# Altium schematic sheet Schematic.SchDoc
size 420 x 297 mm; SheetNumber: 1; SheetTotal: 1; Scale: ---; Title1str: {Наименование строка 2}; PageSetup: Record=PageOptions|CenterHorizontal=False|CenterVertical=False|PrintScale=0.95|XCorrection=0.00|YCorrection=0.00|PrintKind=1|BorderSize=5000000|LeftOffset=0|BottomOffset=0|Orientation=1|PaperLength=1000|PaperWidth=1000|Scale=100|PaperSource=15|PrintQuality=600|MediaType=1|DitherType=10|PaperKind=A4|PrintScaleMode=1; Title2str: {Наименование строка 3}; ProcessInspection: {Т.контр.}; Mass: ---; NormInspection: {Н.контр.}; Letter1Column: О; Letter2Column: {L}; DocumentType: {Документ}; DocumentType1str: {Документ}; DocumentType2str: {Документ}; SpravNomer: {Справ. №}; Title3str: Схема электрическая принципиальная
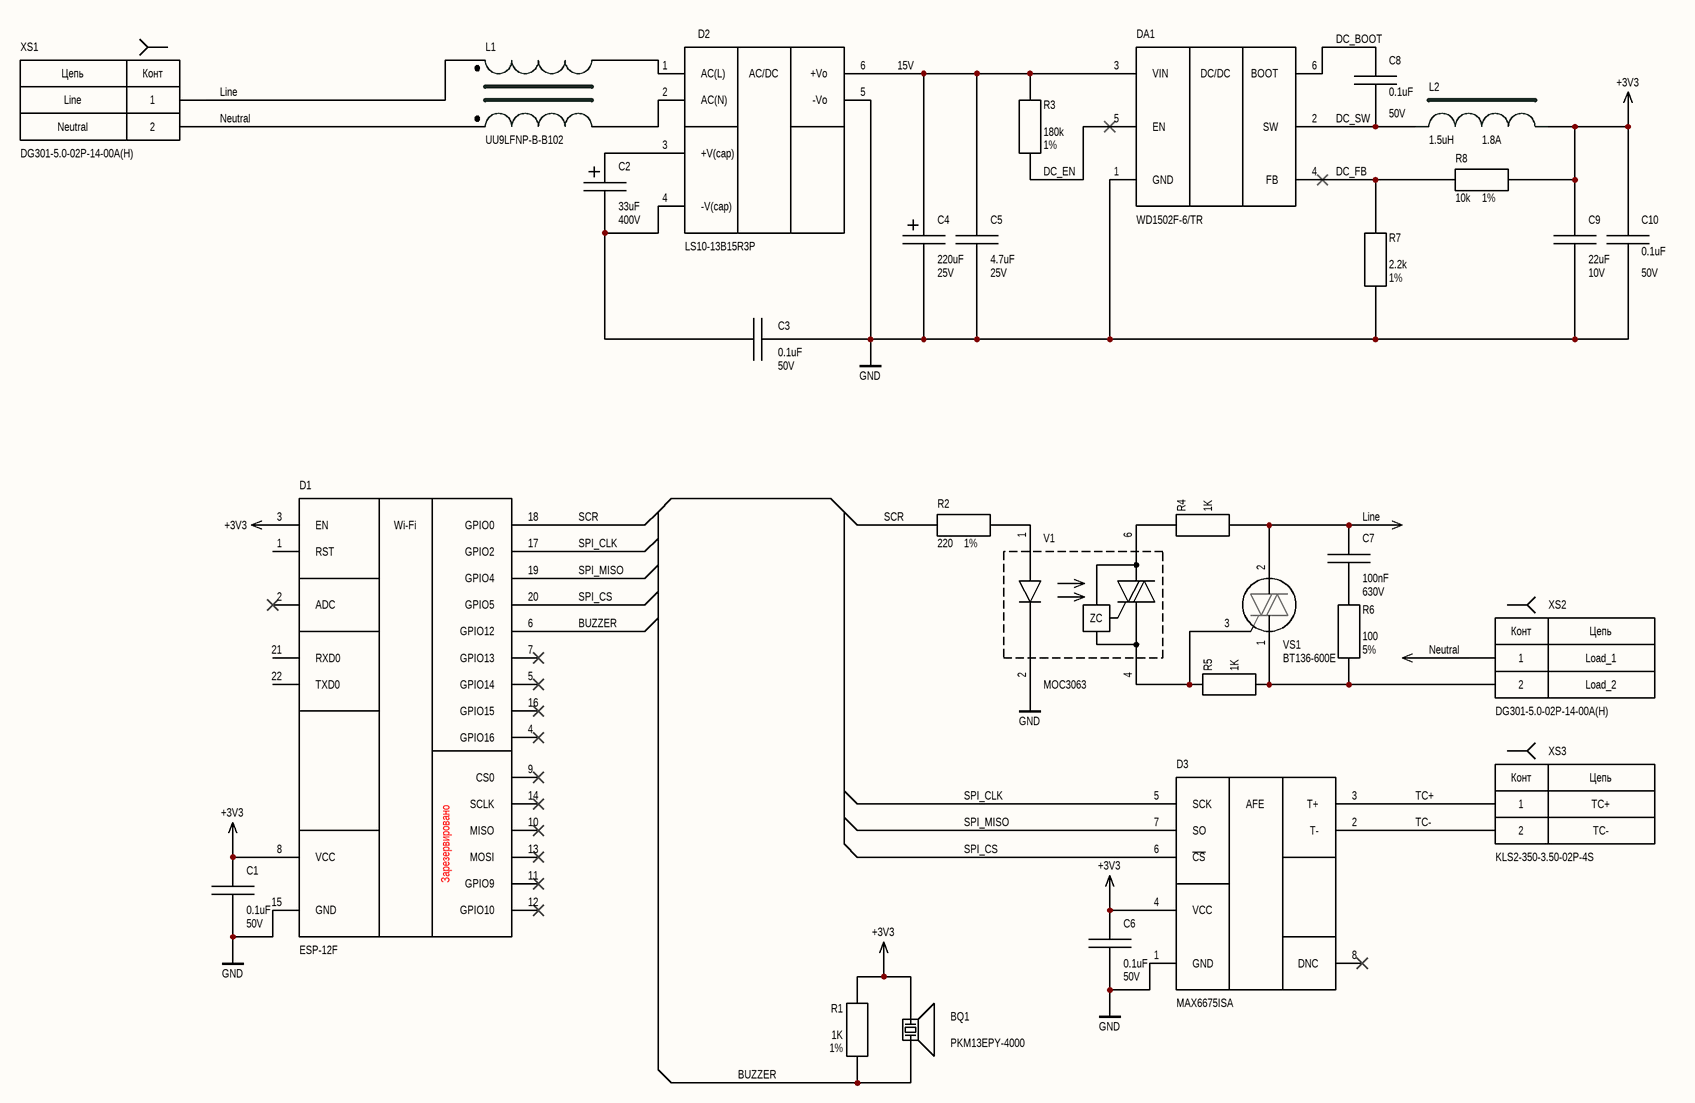
[diagram p0: Schematic.SchDoc]

## Parts
BQ1  PKM13EPY-4000  [R_D12p6_H6p9_S5_d0p5]
C1  0.1uF  Parameter: 50V  [CAPC1608X09N]
C2  33uF  Parameter: 400V
C3  0.1uF  Parameter: 50V  [CAPC1608X09N]
C4  220uF  Parameter: 25V
C5  4.7uF  Parameter: 25V  [CAPC3216X19N]
C6  0.1uF  Parameter: 50V  [CAPC1608X09N]
C7  100nF  Parameter: 630V  [CAPRR1600W70L1750T600H1200]
C8  0.1uF  Parameter: 50V  [CAPC1608X09N]
C9  22uF  Parameter: 10V  [CAPC3216X19N]
C10  0.1uF  Parameter: 50V  [CAPC1608X09N]
D1  ESP-12F  [ESP-12F]
D2  LS10-13B15R3P  [LS10-13BxxR3P_LUT]
D3  MAX6675ISA  [SOIC8P127_490X600X175L83X42N]
DA1  WD1502F-6/TR  [SOT23-6P95_280X90L45X42N]
L1  UU9LFNP-B-B102  [UU9LF]
L2  1.5uH  Parameter: 1.8A  [INDP400L400WX180_N]
R1  1K  Parameter: 1%  [RESC1608X55N]
R2  220  Parameter: 1%  [RESC1608X55N]
R3  180k  Parameter: 1%  [RESC1608X55N]
R4  1K  [RESC1608X55N]
R5  1K  [RESC1608X55N]
R6  100  Parameter: 5%  [MF-05W_RESAD1400W60L1000D500]
R7  2.2k  Parameter: 1%  [RESC1608X55N]
R8  10k  Parameter: 1%  [RESC1608X55N]
V1  MOC3063  [DIP-6_DIP762W50P254L735H400Q6]
VS1  BT136-600Е  [TO-220C_TO254_440P1040X460X2000-3]
XS1  DG301-5.0-02P-14-00A(H)  [DG301-5.0-02P]
XS2  DG301-5.0-02P-14-00A(H)  [DG301-5.0-02P]
XS3  KLS2-350-3.50-02P-4S  [KLS2-350-3.50-02P-4S]

## Nets
+3V3: BQ1.1 C1.1 C6.1 C9.1 C10.1 D1.3(EN) D1.8(VCC) D3.4(VCC) L2.2 R1.2 R8.2
GND: C1.2 C3.2 C4.1 C5.2 C6.2 C9.2 C10.2 D1.15(GND) D2.5(-Vo) D3.1(GND) DA1.1(GND) R7.1 V1.2(-)
15V: C4.2 C5.1 D2.6(+Vo) DA1.3(VIN) R3.2
BUZZER: BQ1.2 D1.6(GPIO12) R1.1
DC_BOOT: C8.1 DA1.6(BOOT)
DC_EN: DA1.5(EN) R3.1
DC_FB: DA1.4(FB) R7.2 R8.1
DC_SW: C8.2 DA1.2(SW) L2.1
Line: C7.1 L1.1 R4.1 VS1.2(T2) XS1.1
Neutral: L1.4 XS1.2 XS2.1
SCR: D1.18(GPIO0) R2.1
SPI_CLK: D1.17(GPIO2) D3.5(SCK)
SPI_CS: D1.20(GPIO5) D3.6(~{CS})
SPI_MISO: D1.19(GPIO4) D3.7(SO)
TC+: D3.3(T+) XS3.1
TC-: D3.2(T-) XS3.2
NetC2_1: C2.1 C3.1 D2.4(-V(cap))
NetC2_2: C2.2 D2.3(+V(cap))
NetC7_2: C7.2 R6.2
NetD2_1: D2.1(AC(L)) L1.2
NetD2_2: D2.2(AC(N)) L1.3
NetR2_2: R2.2 V1.1(+)
NetR4_2: R4.2 V1.6
NetR5_1: R5.1 R6.1 VS1.1(T1) XS2.2
NetR5_2: R5.2 V1.4 VS1.3(G)

Not connected (* = marked no-connect by the designer): D1 1(RST) 2(ADC)* 4(GPIO16)* 5(GPIO14)* 7(GPIO13)* 9(CS0)* 10(MISO)* 11(GPIO9)* 12(GPIO10)* 13(MOSI)* 14(SCLK)* 16(GPIO15)* 21(RXD0) 22(TXD0); D3 8(DNC)*

## Notes on the sheet
- Line
- Neutral
- Load_1
- Load_2
- TC+
- TC-
- Перв. примен.
- Справ. №
- Подп. и дата
- Инв. № дубл.
- Взам. инв. №
- Изм.
- Лист
- № докум.
- Подп.
- Дата
- Лит.
- Масса
- Масштаб
- Т.контр.
- Пров.
- Разраб.
- Листов
- Инв. № подл.
- Н. контр.
- Утв.
- Копировал:
- Формат А3
- (in symbol DG301-5.0-02P-14-00A(H)) Цепь; Конт
- (in symbol ESP-12F) Wi-Fi; Зарезервировано
- (in symbol KLS2-350-3.50-02P-4S) Конт; Цепь
- (in symbol LS10-13B15R3P) AC/DC
- (in symbol MAX6675ISA) AFE
- (in symbol MOC3063) ZC
- (in symbol WD1502F-6/TR) DC/DC

## Library data of the parts
BQ1 = PKM13EPY-4000: Manufacturer: Murata; Part Number: PKM13EPY-4000; ComponentLink1URL: https://pdf1.alldatasheet.com/datasheet-pdf/view/116967/MURATA/PKM13EPY-4000-A0.html; ComponentLink1Description: Datasheet; Package: TH; Part Status: Active
C1 C3 C6 C8 C10 = 0603-0.1uF-50V-10%-X7R: Tolerance: 10%; Dielectric: X7R; Min Temperature: -55; Max Temperature: 125; Part Number: 0603-0.1uF-50V-10%-X7R; Package: 0603; Part Status: Active; Capacitance: 0.1uF; Voltage: 50V
C2 = SHG33UF400V01EC1480: Manufacturer: KNSCHA; Part Number: SHG33UF400V01EC1480; ComponentLink1URL: https://datasheet.lcsc.com/lcsc/2204261000_KNSCHA-SHG33UF400V01EC1480_C2998036.pdf; ComponentLink1Description: Datasheet; Capacitance: 33uF; Voltage: 400V
C4 = 03EC0360: Manufacturer: KNSCHA; Part Number: 03EC0360; ComponentLink1URL: https://datasheet.lcsc.com/lcsc/2105241444_KNSCHA-03EC0360_C2833303.pdf; ComponentLink1Description: Datasheet; Capacitance: 220uF; Voltage: 25V
C5 = 1206-4.7uF-25V-10%-X7R: Tolerance: 10%; Dielectric: X7R; Min Temperature: -55; Max Temperature: 125; Part Number: 1206-4.7uF-25V-10%-X7R; Package: 1206; Part Status: Active; Capacitance: 4.7uF; Voltage: 25V
C7 = MEF104J2J6AS6040A1: Manufacturer: JOEY; Tolerance: 5%; Dielectric: Polyester; Min Temperature: -55; Max Temperature: 105; Part Number: MEF104J2J6AS6040A1; ComponentLink1URL: https://datasheet.lcsc.com/lcsc/2311211613_JOEY-MEF104J2J6AS6040A1_C18295882.pdf; ComponentLink1Description: Datasheet; Package: TH; Part Status: Active; Capacitance: 100nF; Voltage: 630V
C9 = 1206-22uF-10V-10%-X7R: Tolerance: 10%; Dielectric: X7R; Min Temperature: -55; Max Temperature: 125; Part Number: 1206-22uF-10V-10%-X7R; Package: 1206; Part Status: Active; Capacitance: 22uF; Voltage: 10V
D1 = ESP-12F: Manufacturer: Ai-Thinker; Part Number: ESP-12F; ComponentLink1URL: https://datasheet.lcsc.com/lcsc/2102191804_Ai-Thinker-ESP-12F-ESP8266MOD_C82891.pdf; ComponentLink1Description: Datasheet; Package: QFN-44; Part Status: Active
D2 = LS10-13B15R3P: Manufacturer: MORNSUN Guangzhou S& T; Part Number: LS10-13B15R3P; ComponentLink1URL: https://datasheet.lcsc.com/lcsc/2304140030_MORNSUN-Guangzhou-S--T-LS10-13B15R3P_C2684858.pdf; ComponentLink1Description: Datasheet
D3 = MAX6675ISA: Manufacturer: Analog Devices Inc./Maxim Integrated; Part Number: MAX6675ISA; ComponentLink1URL: https://datasheet.lcsc.com/lcsc/1810181421_Analog-Devices-Inc--Maxim-Integrated-MAX6675ISA-T_C16030.pdf; ComponentLink1Description: Datasheet; Package: SOIC-8; Part Status: Active
DA1 = WD1502F-6/TR: Manufacturer: WILLSEMI(Will Semicon); Part Number: WD1502F-6/TR; ComponentLink1URL: https://datasheet.lcsc.com/lcsc/2201121500_WILLSEMI-Will-Semicon-WD1502F-6-TR_C2931307.pdf; ComponentLink1Description: Datasheet; Package: SOT23-6; Part Status: Active
L1 = UU9LFNP-B-B102: Manufacturer: Sumida; Part Number: UU9LFNP-B-B102; ComponentLink1URL: https://www.promelec.ru/fs/sources/7d/fb/00/93/a0ed9916e485af1b33b50f4f.pdf; ComponentLink1Description: Datasheet; Part Status: Active
L2 = SWPA4018S1R5NT: Manufacturer: Sunlord; Tolerance: 30%; Resistance: 0.039; Self Resonant Frequency: 65MHz; Saturation Current: 3.35A; Part Number: SWPA4018S1R5NT; ComponentLink1URL: https://datasheet.lcsc.com/lcsc/2110091630_Sunlord-SWPA4018S1R5NT_C80662.pdf; ComponentLink1Description: Datasheet; Package: 4018; Part Status: Active; Inductance: 1.5uH; Rated Current: 1.8A
R1 = 0603-1K-1%-1/10 W-100ppm: Resistor; Power: 1/10 W; Temperature Coefficient: 100ppm; Min Temperature: -55°C; Max Temperature: 155°C; Part Number: 0603-1K-1%-1/10 W-100ppm; Package: 0603; Part Status: Active; Resistance: 1K; Tolerance: 1%
R2 = 0603-220-1%-1/10 W-100ppm: Resistor; Power: 1/10 W; Temperature Coefficient: 100ppm; Min Temperature: -55°C; Max Temperature: 155°C; Part Number: 0603-220-1%-1/10 W-100ppm; Package: 0603; Part Status: Active; Resistance: 220; Tolerance: 1%
R3 = 0603-180K-1%-1/10W-100ppm: Resistor; Power: 1/10 W; Temperature Coefficient: 100ppm; Min Temperature: -55°C; Max Temperature: 155°C; Part Number: 0603-180K-1%-1/10W-100ppm; Package: 0603; Part Status: Active; Resistance: 180k; Tolerance: 1%
R4 R5 = 0603-1K-1%-1/10 W-100ppm: Resistor; Tolerance: 1%; Power: 1/10 W; Temperature Coefficient: 100ppm; Min Temperature: -55°C; Max Temperature: 155°C; Part Number: 0603-1K-1%-1/10 W-100ppm; Package: 0603; Part Status: Active; Resistance: 1K
R6 = MF0W2JJ0101A10: Resistor; Manufacturer: UNI-ROYAL(Uniroyal Elec); Power: 500mW; Temperature Coefficient: 200ppm; Min Temperature: -55; Max Temperature: 105; Part Number: MF0W2JJ0101A10; ComponentLink1URL: https://datasheet.lcsc.com/lcsc/2310191505_UNI-ROYAL-Uniroyal-Elec-MF0W2JJ0101A10_C18724264.pdf; ComponentLink1Description: Datasheet; Package: TH; Part Status: Active; Resistance: 100; Tolerance: 5%
R7 = 0603-2.2K-1%-1/10W-100ppm: Resistor; Power: 1/10 W; Min Temperature: -55°C; Max Temperature: 155°C; Part Number: 0603-2.2K-1%-1/10W-100ppm; Package: 0603; Part Status: Active; Resistance: 2.2k; Tolerance: 1%; Temperature Coefficient: 1/10 W
R8 = 0603-10k-1%-1/10 W-100ppm: Resistor; Power: 1/10 W; Temperature Coefficient: 100ppm; Min Temperature: -55°C; Max Temperature: 155°C; Part Number: 0603-10k-1%-1/10 W-100ppm; Package: 0603; Part Status: Active; Resistance: 10k; Tolerance: 1%
V1 = MOC3063: Оптрон тиристорный; Manufacturer: Lite-On; Part Number: MOC3063; ComponentLink1URL: https://datasheet.lcsc.com/lcsc/2304140030_Lite-On-MOC3063_C78487.pdf; ComponentLink1Description: Datasheet; Package: DIP-6; Part Status: Active
VS1 = BT136-600Е: Manufacturer: WEIDA; Part Number: BT136-600Е; ComponentLink1URL: https://datasheet.lcsc.com/lcsc/2203021730_WEIDA-BT136-600E_C2901007.pdf; ComponentLink1Description: Datasheet; Package: TO-220C; Part Status: Active
XS1 XS2 = DG301-5.0-02P-14-00A(H): Manufacturer: DEGSON; Part Number: DG301-5.0-02P-14-00A(H); ComponentLink1URL: https://datasheet.lcsc.com/lcsc/2208121800_DEGSON-DG301-5-0-02P-14-00A-H_C5128812.pdf; ComponentLink1Description: Datasheet; Part Status: Active
XS3 = KLS2-350-3.50-02P-4S: Manufacturer: KLS; Part Number: KLS2-350-3.50-02P-4S; ComponentLink1URL: https://img.klsele.com/admin/product_upload/20170915092321350%20he.pdf; ComponentLink1Description: Datasheet; Part Status: Active